# EAGLE design rev0.1 (EAGLE 8.1.0)
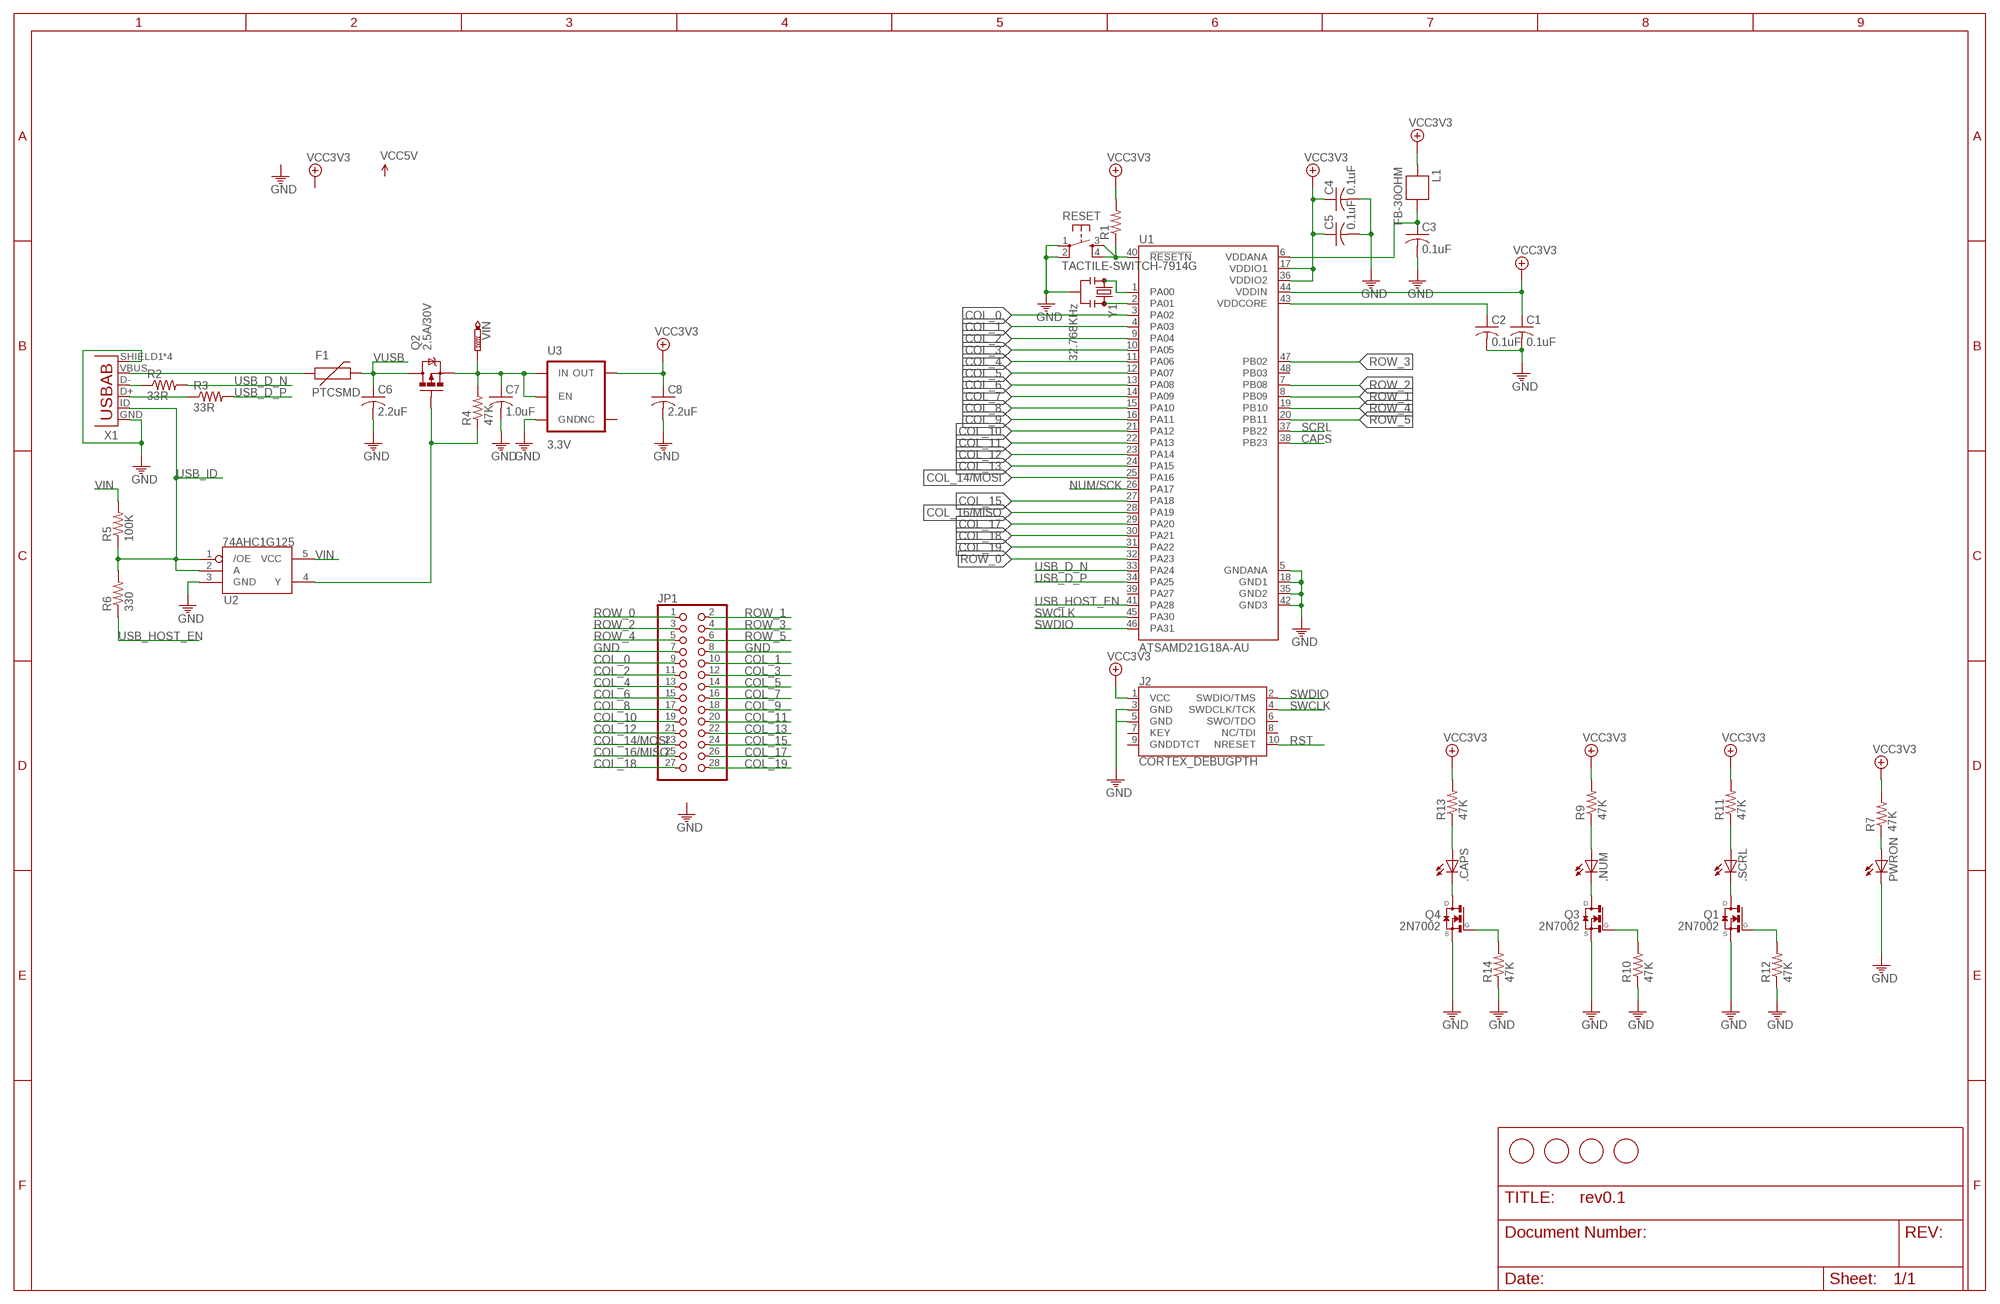
[diagram p0: schematic, sheet 1]

## Parts
.CAPS  LEDCHIPLED_1206  [CHIPLED_1206]
.NUM  LEDCHIPLED_1206  [CHIPLED_1206]
.SCRL  LEDCHIPLED_1206  [CHIPLED_1206]
C1  0.1uF  C-USC0603  [C0603]
C2  0.1uF  C-USC0603  [C0603]
C3  0.1uF  C-USC0603  [C0603]
C4  0.1uF  C-USC0603  [C0603]
C5  0.1uF  C-USC0603  [C0603]
C6  2.2uF  C-USC0603  [C0603]
C7  1.0uF  C-USC0603  [C0603]
C8  2.2uF  C-USC0603  [C0603]
F1  PTCSMD  [PTC-1206]
J2  CORTEX_DEBUGPTH  [2X5-PTH-1.27MM]
JP1  PINHD-2X14-CB  [2X14-CLEANBIG]
L1  FB-30OHM  FB  [0603]
PWRON  LEDCHIPLED_1206  [CHIPLED_1206]
Q1  2N7002  [SOT23]
Q2  2.5A/30V  MOSFET-PCHANNELDMG2307L  [SOT23-3]
Q3  2N7002  [SOT23]
Q4  2N7002  [SOT23]
R1  R-US_R0603  [R0603]
R2  33R  R-US_R0603  [R0603]
R3  33R  R-US_R0603  [R0603]
R4  47K  R-US_R0603  [R0603]
R5  100K  R-US_R0603  [R0603]
R6  330  R-US_R0603  [R0603]
R7  47K  R-US_R0603  [R0603]
R9  47K  R-US_R0603  [R0603]
R10  47K  R-US_R0603  [R0603]
R11  47K  R-US_R0603  [R0603]
R12  47K  R-US_R0603  [R0603]
R13  47K  R-US_R0603  [R0603]
R14  47K  R-US_R0603  [R0603]
RESET  TACTILE-SWITCH-7914G  [7914G]
U1  ATSAMD21G18A-AU  [QFP50P900X900X120-48N]
U2  74AHC1G125  [SOT23-5]
U3  3.3V  V_REG_AP2112K-3.3V  [SOT23-5]
U$6  FIDUCIAL  [FIDUCIAL_1MM]
U$19  FIDUCIAL  [FIDUCIAL_1MM]
U$20  FIDUCIAL  [FIDUCIAL_1MM]
U$21  FIDUCIAL  [FIDUCIAL_1MM]
VIN  PTR1PAD1-17  [P1-17]
X1  USB-AB"  [USB_AB_MICRO_1:1_V2]
Y1  32.768KHz  RESONATOR16MHZ  [RESONATOR-SMD]

## Nets
CAPS: Q4.1(G) R14.2 U1.38(PB23)
COL_0: JP1.9 U1.3(PA02)
COL_1: JP1.10 U1.4(PA03)
COL_2: JP1.11 U1.9(PA04)
COL_3: JP1.12 U1.10(PA05)
COL_4: JP1.13 U1.11(PA06)
COL_5: JP1.14 U1.12(PA07)
COL_6: JP1.15 U1.13(PA08)
COL_7: JP1.16 U1.14(PA09)
COL_8: JP1.17 U1.15(PA10)
COL_9: JP1.18 U1.16(PA11)
COL_10: JP1.19 U1.21(PA12)
COL_11: JP1.20 U1.22(PA13)
COL_12: JP1.21 U1.23(PA14)
COL_13: JP1.22 U1.24(PA15)
COL_14/MOSI: JP1.23 U1.25(PA16)
COL_15: JP1.24 U1.27(PA18)
COL_16/MISO: JP1.25 U1.28(PA19)
COL_17: JP1.26 U1.29(PA20)
COL_18: JP1.27 U1.30(PA21)
COL_19: JP1.28 U1.31(PA22)
D_N: R2.1 X1.D-
D_P: R3.1 X1.D+
GND: C1.2 C2.2 C3.2 C4.2 C5.2 C6.2 C7.2 C8.2 J2.3(GND) J2.5(GND) JP1.7 JP1.8 PWRON.C Q1.2(S) Q3.2(S) Q4.2(S) R10.1 R12.1 R14.1 RESET.1 RESET.2 U1.5(GNDANA) U1.18(GND1) U1.35(GND2) U1.42(GND3) U2.3(GND) U3.2(GND) X1.GND X1.SHIELD1(SHIELD) X1.SHIELD2(SHIELD) X1.SHIELD3(SHIELD) X1.SHIELD4(SHIELD) Y1.2
N$1: U1.1(PA00) Y1.1
N$2: C2.1 U1.43(VDDCORE)
N$3: U1.2(PA01) Y1.3
N$4: C3.1 L1.1 U1.6(VDDANA)
N$6: Q2.1(G) R4.1 U2.4(Y)
N$9: PWRON.A R7.1
N$10: .SCRL.A R11.1
N$11: .NUM.A R9.1
N$12: .NUM.C Q3.3(D)
N$15: .SCRL.C Q1.3(D)
N$24: .CAPS.A R13.1
N$25: .CAPS.C Q4.3(D)
NUM/SCK: Q3.1(G) R10.2 U1.26(PA17)
ROW_0: JP1.1 U1.32(PA23)
ROW_1: JP1.2 U1.8(PB09)
ROW_2: JP1.3 U1.7(PB08)
ROW_3: JP1.4 U1.47(PB02)
ROW_4: JP1.5 U1.19(PB10)
ROW_5: JP1.6 U1.20(PB11)
RST: J2.10(NRESET) R1.1 RESET.3 RESET.4 U1.40(!RESETN)
SCRL: Q1.1(G) R12.2 U1.37(PB22)
SWCLK: J2.4(SWDCLK/TCK) U1.45(PA30)
SWDIO: J2.2(SWDIO/TMS) U1.46(PA31)
USB_D_N: R2.2 U1.33(PA24)
USB_D_P: R3.2 U1.34(PA25)
USB_HOST_EN: R6.1 U1.41(PA28)
USB_ID: R5.1 R6.2 U2.1(/OE) U2.2(A) X1.ID(USBID)
USBVIN: F1.1 X1.VBUS
VCC3V3: C1.1 C4.1 C5.1 C8.1 J2.1(VCC) L1.2 R1.2 R7.2 R9.2 R11.2 R13.2 U1.17(VDDIO1) U1.36(VDDIO2) U1.44(VDDIN) U3.5(OUT)
VIN: C7.1 Q2.2(S) R4.2 R5.2 U2.5(VCC) U3.1(IN) U3.3(EN) VIN.TP
VUSB: C6.1 F1.2 Q2.3(D)
Unconnected: J2.6(SWO/TDO) J2.7(KEY) J2.8(NC/TDI) J2.9(GNDDTCT) U1.39(PA27) U1.48(PB03) U3.4(NC)

## Library data of the parts
.CAPS .NUM .SCRL PWRON = adafruit:LED: LED OSRAM: - CHIPLED LG R971, LG N971, LY N971, LG Q971, LY Q971, LO R971, LY R971 LH N974, LH R974 LS Q976, LO Q976, LY Q976 LO Q996 - Hyper CHIPLED LW Q18S LB Q993, LB Q99A, LB R99A - SideLED LS A670, LO A670, LY A670, LG A670, LP A670 LB A673, LV A673, LT A673, LW A673 LH A674 LY A675 LS A676, LA A676, LO A676, LY A676, LW A676 LS A679, LY A679, LG A679 - Hyper Micro SIDELED® LS Y876, LA Y876, LO Y876, LY Y876 LT Y87S - SmartLED LW L88C, LW L88S LB L89C, LB L89S, LG L890 LS L89K, LO L89K, LY L89K LS L896, LA L896, LO L896, LY L896 - TOPLED LS T670, LO T670, LY T670, LG T670, LP T670 LSG T670, LSP T670, LSY T670, LOP T670, LYG T670 LG T671, LOG T671, LSG T671 LB T673, LV T673, LT T673, LW T673 LH T674 LS T676, LA T676, LO T676, LY T676, LB T676, LH T676, LSB T676, LW T676 LB T67C, LV T67C, LT T67C, LS T67K, LO T67K, LY T67K, LW E67C LS E67B, LA E67B, LO E67B, LY E67B, LB E67C, LV E67C, LT E67C LW T67C LS T679, LY T679, LG T679 LS T770, LO T770, LY T770, LG T770, LP T770 LB T773, LV T773, LT T773, LW T773 LH T774 LS E675, LA E675, LY E675, LS T675 LS T776, LA T776, LO T776, LY T776, LB T776 LHGB T686 LT T68C, LB T68C - Hyper Mini TOPLED® LB M676 - Mini TOPLED Santana® LG M470 LS M47K, LO M47K, LY M47K Source: http://www.osram.convergy.de/
C1-C8 = resistor:C-US: CAPACITOR, American symbol
F1 = SparkFun-PowerIC:PTC: Resettable Fuse PTC Resettable Fuse. Spark Fun Electronics SKU : COM-08357; PROD_ID: RES-11150
J2 = SparkFun-Connectors:CORTEX_DEBUG: Cortex Debug Connector Datasheet <http://infocenter.arm.com/help/topic/com.arm.doc.faqs/attached/13634/cortex_debug_connectors.pdf>
JP1 = adafruit:PINHD-2X14: PIN HEADER
L1 = SparkFun-Passives:FB
Q1 Q3 Q4 = transistor-fet:2N7002*: N-Channel MOSFET
Q2 = SparkFun-DiscreteSemi:MOSFET-PCHANNEL: Generic PMOSFET IRLML2244 - TRANS-11153 (SOT-23 -20V -4.3A) (1.Gate 2.Source 3.Drain) FQP27P06 - COM-10349 <http://www.sparkfun.com/products/10349> (TO-220 -60V -27A) (1.Gate 2.Source 3.Drain); PROD_ID: TRANS-11308
R1-R7 R9-R14 = resistor:R-US_: RESISTOR, American symbol
RESET = GeekAmmo:TACTILE-SWITCH: Tactile Switch 4 Pins, SPST NO
U1 = ATSAMD21G18A-AU:ATSAMD21G18A-AU: Cortex-M0+, 256KB FLASH, 32KB SRAM, USB, DMA, T&R - 48TQFP IND TEMP, GREEN, 1.6-3.6V, 48MHz; AVAILABILITY: Good; DESCRIPTION: Cortex-M0+, 256KB FLASH, 32KB SRAM, USB, DMA, T&amp;R - 48TQFP IND TEMP, GREEN, 1.6-3.6V, 48MHz; MF: Atmel; MP: ATSAMD21G18A-AU; PACKAGE: TQFP-48 Atmel; PRICE: 3.04 USD
U2 = SparkFun-DigitalIC:74AHC1G125: Single bus buffer gate with 3-state output; PROD_ID: IC-11920
U3 = SparkFun-PowerIC:V_REG_AP2112: AP2112 - 600mA CMOS LDO Regulator w/ Enable The AP2112 is CMOS process low dropout linear regulator with enable function, the regulator delivers a guaranteed 600mA (min.) continuous load current. Features Output Voltage Accuracy: ±1.5% Output Current: 600mA (Min.) Foldback Short Current Protection: 50mA Enable Function to Turn ON/OFF VOUT Low Dropout Voltage (3.3V): 250mV (Typ.) @IOUT=600mA Excellent Load Regulation: 0.2%/A (Typ.) Excellent Line Regulation: 0.02%/V (Typ.) Low Quiescent Current: 55μA (Typ.) Low Standby Current: 0.01μA (Typ.) Low Output Noise: 50μVRMS PSRR: 100Hz -65dB, 1kHz -65dB OTSD Protection Stable with 1.0μF Flexible Cap: Ceramic, Tantalum and Aluminum Electrolytic Operation Temperature Range: -40°C to 85°C ESD: MM 400V, HBM 4000V; PROD_ID: VREG-12457
U$6 U$19-U$21 = adafruit:FIDUCIAL: For use by pick and place machines to calibrate the vision/machine, 1mm By microbuilder.eu
VIN = testpad:PTR1: TEST PIN
X1 = SparkFun-Connectors:USB-AB: This is a USB AB connector that is compatible with USB OTG. i.e. this connector can serve as a host or device
Y1 = SparkFun-FreqCtrl:RESONATOR: Resonator Small SMD resonator. Used, eg, on the Arduino Pro/ Pro Mini boards. 8MHz- XTAL-08895 16MHz- XTAL-08900; PROD_ID: XTAL-08900; VALUE: 16MHZ

## Board
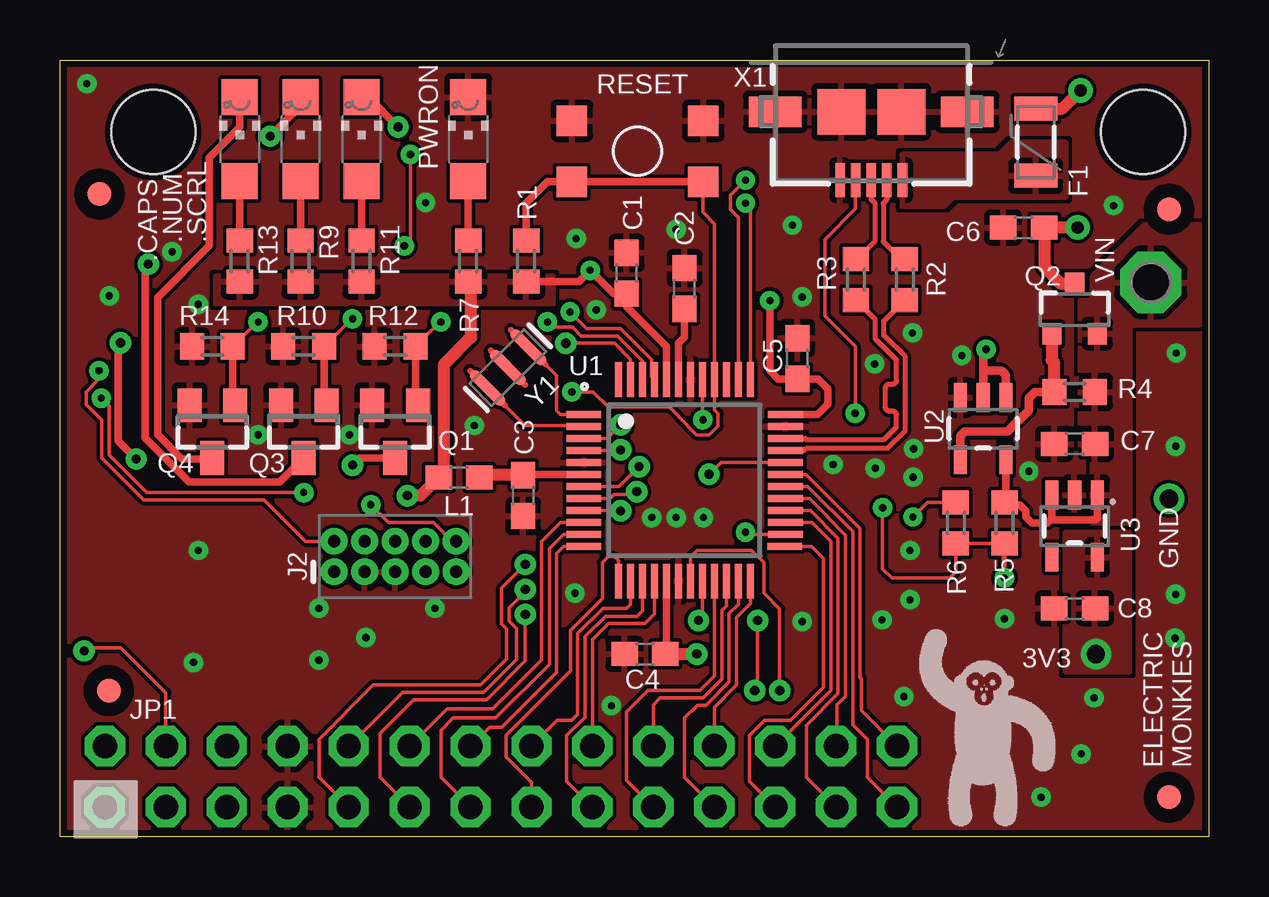
[diagram p1: board, top side]
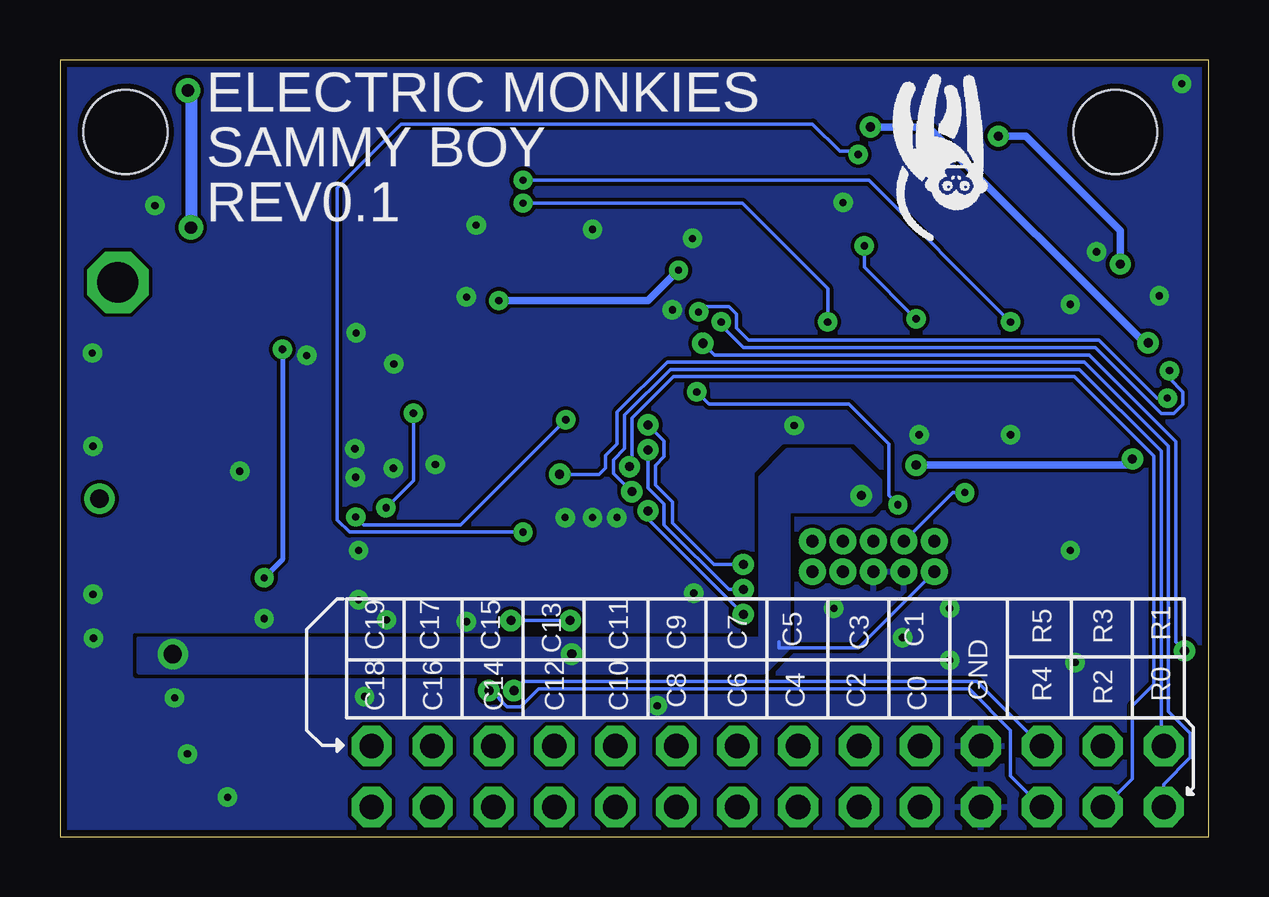
[diagram p2: board, bottom side, seen from below]

Size 47.88 x 32.38 mm. Coordinates in mm from the lower left corner, seen from the top.
Outline: 0,0 0,32.38 47.88,32.38 47.88,0 0,0
Copper layers (1*16): Top 0.035mm / dielectric 1.5mm / Bottom 0.035mm
Design rules "SparkFun *": minimum track width 6mil, minimum drill 0.3mm, track to track 6mil, track to pad 6mil, pad to pad 6mil, via to via 6mil, smd to smd 6mil, copper to edge 10mil, drill to drill 8mil, minimum pad ring 12mil, minimum via ring 10mil, stop-mask expansion 4mil, vias tented up to drill 15mil, thermal gap 10mil
Holes 3.5 mm at 45.14,29.38 3.89,29.38

### Footprints (pad centres in the part's own frame; a part is rotated, then mirrored left to right if it is on the bottom)
CHIPLED_1206 = smd 1.5 x 1.5: A 0,-1.75; C 0,1.75
C0603 = smd 1.1 x 1: 1 -0.85,0; 2 0.85,0
PTC-1206 = smd 1 x 1.8: 1 -1.4,0; 2 1.4,0
2X5-PTH-1.27MM = drill 0.508 pad 1: 1 -2.54,-0.635; 2 -2.54,0.635; 3 -1.27,-0.635; 4 -1.27,0.635; 5 0,-0.635; 6 0,0.635; 7 1.27,-0.635; 8 1.27,0.635; 9 2.54,-0.635; 10 2.54,0.635
2X14-CLEANBIG = drill 1.016 pad 1.676 octagon: 1 -16.51,-1.27; 2 -16.51,1.27; 3 -13.97,-1.27; 4 -13.97,1.27; 5 -11.43,-1.27; 6 -11.43,1.27; 7 -8.89,-1.27; 8 -8.89,1.27; 9 -6.35,-1.27; 10 -6.35,1.27; 11 -3.81,-1.27; 12 -3.81,1.27; 13 -1.27,-1.27; 14 -1.27,1.27; 15 1.27,-1.27; 16 1.27,1.27; 17 3.81,-1.27; 18 3.81,1.27; 19 6.35,-1.27; 20 6.35,1.27; 21 8.89,-1.27; 22 8.89,1.27; 23 11.43,-1.27; 24 11.43,1.27; 25 13.97,-1.27; 26 13.97,1.27; 27 16.51,-1.27; 28 16.51,1.27
0603 = smd 1.1 x 1: 1 -0.85,0; 2 0.85,0
SOT23 = smd 1 x 1.4: 1 -0.95,-1.1; 2 0.95,-1.1; 3 0,1.1
SOT23-3 = smd 0.8 x 0.9: 1 -0.95,-1; 2 0.95,-1; 3 0,1.1
R0603 = smd 1 x 1.1: 1 -0.85,0; 2 0.85,0
7914G = smd 1.27 x 1.27: 1 0,0; 2 0,5.486; 3 2.54,0; 4 2.54,5.486
QFP50P900X900X120-48N = smd 1.45 x 0.3: 1 -4.2,2.75; 2 -4.2,2.25; 3 -4.2,1.75; 4 -4.2,1.25; 5 -4.2,0.75; 6 -4.2,0.25; 7 -4.2,-0.25; 8 -4.2,-0.75; 9 -4.2,-1.25; 10 -4.2,-1.75; 11 -4.2,-2.25; 12 -4.2,-2.75; 25 4.17,-2.75; 26 4.2,-2.25; 27 4.2,-1.75; 28 4.2,-1.25; 29 4.2,-0.75; 30 4.2,-0.25; 31 4.2,0.25; 32 4.2,0.75; 33 4.2,1.25; 34 4.2,1.75; 35 4.2,2.25; 36 4.2,2.75 | smd 0.3 x 1.45: 13 -2.75,-4.2; 14 -2.25,-4.2; 15 -1.75,-4.2; 16 -1.25,-4.2; 17 -0.75,-4.2; 18 -0.25,-4.2; 19 0.25,-4.2; 20 0.75,-4.2; 21 1.25,-4.2; 22 1.75,-4.2; 23 2.25,-4.2; 24 2.75,-4.2; 37 2.75,4.2; 38 2.25,4.2; 39 1.75,4.2; 40 1.25,4.2; 41 0.75,4.2; 42 0.25,4.2; 43 -0.25,4.2; 44 -0.75,4.2; 45 -1.25,4.2; 46 -1.75,4.2; 47 -2.25,4.2; 48 -2.75,4.2
SOT23-5 = smd 0.55 x 1.2: 1 -0.95,-1.3; 2 0,-1.3; 3 0.95,-1.3; 4 0.95,1.3; 5 -0.95,1.3
FIDUCIAL_1MM = smd 1 x 1: 1 0,0
P1-17 = drill 1.702 pad 2.54 octagon: TP 0,0
USB_AB_MICRO_1:1_V2 = smd 1.4 x 0.4: D+ 2.85,0; D- 2.85,0.65; GND 2.85,-1.3; ID 2.85,-0.65; VBUS 2.85,1.3 | smd 1.27 x 2.2: SHIELD1 0,4; SHIELD4 0,-4 | smd 1.9 x 2: SHIELD2 0,1.25; SHIELD3 0,-1.25
RESONATOR-SMD = smd 0.45 x 1.905: 1 -1.2,0; 2 0,0; 3 1.2,0

### Placement (x,y rotation side)
.CAPS  7.49,29.08 0 top
.NUM  10.03,29.08 0 top
.SCRL  12.57,29.08 0 top
C1  23.62,23.5 90 top
C2  26.04,22.86 90 top
C3  19.3,14.22 270 top
C4  24.38,7.62 180 top
C5  30.73,19.94 90 top
C6  40.16,25.4 180 top
C7  42.29,16.38 180 top
C8  42.29,9.53 180 top
DRILEGEND  [DRILEGEND]  76.83,36.2 0 top  (outside the outline)
F1  40.67,28.96 90 top
J2  13.97,11.68 0 top
JP1  18.38,2.51 0 top
L1  16.64,14.99 180 top
PWRON  17.02,29.08 0 top
Q1  13.97,16.89 180 top
Q2  42.29,21.97 0 top
Q3  10.16,16.89 180 top
Q4  6.35,16.89 180 top
R1  19.43,24 270 top
R2  35.21,23.23 270 top
R3  33.18,23.23 270 top
R4  42.29,18.54 0 top
R5  39.37,13.08 90 top
R6  37.34,13.08 270 top
R7  17.02,24 270 top
R9  10.03,24 270 top
R10  10.16,20.45 0 top
R11  12.57,24 270 top
R12  13.97,20.45 0 top
R13  7.49,24 270 top
R14  6.35,20.45 0 top
RESET  21.34,29.84 270 top
U1  26.04,14.86 0 top
U2  38.48,17.02 180 top
U3  42.29,12.95 180 top
U$6  1.65,26.8 0 top
U$19  2.03,6.1 0 top
U$20  46.23,1.65 0 top
U$21  46.23,26.16 0 top
VIN  45.47,23.11 270 top
X1  33.81,30.23 270 top
Y1  18.67,19.56 225 top

### Tracks (layer width: path | path; a pad name or v marks a point on that pad's centre or on a via)
CAPS  (via drill 0.3)
  Top 0.152: U1.38 28.29,25.81 27.94,26.15 27.94,26.74 v28.57,27.38 | v8.26,21.46 8.22,21.46 R14.2
  Top 0.305: R14.2 7.2,18.09 Q4.1
  Bottom 0.152: v28.57,27.38 14.17,27.38 v8.26,21.46
COL_0  (via drill 0.38)
  Top 0.152: JP1.9 10.79,2.47 10.79,4.06 13.06,6.33 17.53,6.33 18.62,7.42 18.62,8.66 18.41,8.87 18.41,10.38 v19.39,11.35 | v23.37,17.17 22.81,16.61 U1.3
  Bottom 0.152: v19.39,11.35 20.61,11.35 22.35,13.09 22.35,13.95 23.06,14.66 23.06,15.49 22.7,15.85 22.7,16.5 v23.37,17.17
COL_1  (via drill 0.38)
  Top 0.152: JP1.10 14.27,6.02 17.65,6.02 19.02,7.39 19.02,8.69 18.72,8.99 18.72,9.55 19.11,9.94 19.21,9.94 19.3,10.03 19.3,10.22 v19.39,10.31 | v23.37,16.13 23.35,16.11 U1.4
  Bottom 0.152: v19.39,10.31 20,10.31 22.7,13 22.7,13.87 23.37,14.54 v23.37,16.13
COL_2  (via drill 0.38)
  Top 0.152: JP1.11 13.34,2.47 13.34,4.32 14.73,5.71 17.78,5.71 19.39,7.33 v19.39,9.27 | v23.37,13.59 23.35,13.61 U1.9
  Bottom 0.152: v19.39,9.27 23.37,13.25 v23.37,13.59
COL_3
  Top 0.152: JP1.12 16.13,5.33 18.03,5.33 20.07,7.37 20.07,12.32 20.86,13.11 U1.10
COL_4
  Top 0.152: JP1.13 15.88,2.47 15.88,4.45 16.38,4.95 18.16,4.95 20.4,7.19 20.4,12.01 20.99,12.61 U1.11
COL_5
  Top 0.152: JP1.14 17.91,4.57 18.41,4.57 20.7,6.86 20.7,11.81 21,12.11 U1.12
COL_6
  Top 0.152: U1.13 23.29,11.51 23.11,11.68 22.86,11.68 22.61,11.43 22.61,9.93 21.28,8.6 21.28,6.91 18.58,4.22 18.58,3.34 19.65,2.27 JP1.15
COL_7
  Top 0.152: U1.14 23.79,9.69 23.62,9.53 22.63,9.53 21.58,8.47 21.58,5.11 21.32,4.84 20.72,4.84 JP1.16
COL_8
  Top 0.152: U1.15 24.29,9.43 24.05,9.2 22.73,9.2 21.89,8.35 21.89,4.98 21.12,4.22 21.12,2.31 JP1.17
COL_9
  Top 0.152: U1.16 24.79,9.29 24.38,8.89 22.86,8.89 22.19,8.22 JP1.18
COL_10
  Top 0.152: U1.21 27.29,6.71 26.67,6.1 24.51,6.1 23.62,5.21 23.62,2.35 JP1.19
COL_11
  Top 0.152: U1.22 27.79,9.62 27.59,9.43 27.59,6.58 26.8,5.79 25.02,5.79 24.73,5.5 JP1.20
COL_12
  Top 0.152: U1.23 28.29,9.69 27.89,9.3 27.89,6.46 26.92,5.49 26.57,5.49 26.04,4.95 26.04,2.47 JP1.21
COL_13
  Top 0.152: U1.24 28.79,9.73 28.2,9.15 28.2,6.33 27.27,5.4 JP1.22
COL_14/MOSI
  Top 0.152: JP1.23 28.74,2.31 28.74,4.22 29.37,4.84 30.45,4.84 31.83,6.22 31.83,11.61 31.32,12.11 U1.25
COL_15
  Top 0.152: JP1.24 32.13,6.1 32.13,12.32 31.34,13.11 U1.27
COL_16/MISO
  Top 0.152: JP1.25 31.11,2.47 31.11,4.65 32.44,5.97 32.44,12.45 31.27,13.61 U1.28
COL_17
  Top 0.152: JP1.26 32.38,3.81 32.38,5.49 32.74,5.84 32.74,12.57 32,13.31 32,13.34 31.23,14.11 U1.29
COL_18
  Top 0.152: JP1.27 33.66,2.47 33.66,4.06 33.05,4.67 33.05,12.72 31.16,14.61 U1.30
COL_19
  Top 0.152: JP1.28 33.4,5.27 33.4,6.6 33.35,6.66 33.35,12.85 31.09,15.11 U1.31
D_N
  Top 0.203: X1.D- 34.46,26.57 34.31,26.42 34.31,24.82 35.06,24.07 R2.1
D_P
  Top 0.203: X1.D+ 33.81,26.56 33.96,26.42 33.96,24.82 33.22,24.07 R3.1
GND  (via drill 0.3)
  other vias: 22.99,5.46 35.56,14.99 8.26,16.76 12.06,16.76 35.43,11.94 35.18,5.84 10.79,7.37 15.62,9.53 10.79,9.53 40.39,15.24 37.59,20.07 35.43,9.88 39.37,9.09 34.26,9.04 30.94,8.97 43.1,5.79 42.57,3.45 5.56,7.26 5.77,11.94 2.06,22.56 1.12,31.39 43.92,26.31 46.53,20.17 46.51,16.28 46.51,10.11 46.48,8.28 40.89,1.65 25.68,13.31 30.53,25.5 35.53,21.01 33.96,19.71 35.59,16.18 32.23,15.52 33.99,15.37 30.94,22.5 25.68,25.32 21.51,24.94 15.24,26.44 5.77,22.2 4.67,24.38 12.75,8.31 17.27,17.14 21.46,10.16 22.35,21.97 24.66,13.31 26.82,13.31
  pour Top (rank 5): 0,32.26 47.88,32.26 47.88,0.13 0,0
  pour Bottom (rank 5): 0,32.26 47.88,32.26 47.88,0.13 0,0
N$1
  Top 0.152: U1.1 20.87,17.61 20.7,17.78 20.7,19.22 20.49,19.44 | 20.49,19.44 | 20.49,19.44 Y1.1
N$2
  Top 0.305: C2.1 26.04,20.83 25.78,20.57 U1.43
N$3
  Top 0.152: Y1.3 19.39,17.14 21.8,17.14 U1.2
N$4
  Top 0.305: U1.6 19.34,15.11 C3.1
  Top 0.508: C3.1 17.57,15.07 L1.1
N$5  (via drill 0.76)
  other vias: 46.23,14.1
N$6
  Top 0.356: U2.4 37.53,16.7 37.72,16.89 39.5,16.89 40.39,17.78 40.39,18.29 40.64,18.54 R4.1
  Top 0.508: Q2.1 41.34,19.87 41.44,19.77 R4.1
N$9
  Top 0.305: R7.1 PWRON.A
N$10
  Top 0.305: R11.1 .SCRL.A
N$11
  Top 0.305: R9.1 .NUM.A
N$12  (via drill 0.38)
  Top 0.305: .NUM.C 10.03,30.48 v8.76,29.21 | v3.68,23.88 3.56,23.75 3.56,16.62 5.39,14.79 9.15,14.79 Q3.3
  Bottom 0.305: v8.76,29.21 7.62,29.21 3.68,25.27 v3.68,23.88
N$15  (via drill 0.38)
  Top 0.305: Q1.3 12.49,15.79 v12.19,15.49 | .SCRL.C 12.86,30.83 v14.1,29.59 | v2.52,20.6 2.43,20.5 2.43,16.5 v3.17,15.75
  Bottom 0.305: v12.19,15.49 3.43,15.49 v3.17,15.75 | v2.52,20.6 2.69,20.6 11.68,29.59 v14.1,29.59
N$24
  Top 0.305: R13.1 .CAPS.A
N$25
  Top 0.305: .CAPS.C 7.49,29.59 6.22,28.32 6.22,24.64 4.06,22.48 4.06,16.76 5.08,15.75 6.31,15.75 Q4.3
NUM/SCK  (via drill 0.3)
  Top 0.152: U1.26 28.67,12.61 v28.57,12.7 | v14.61,28.45 14.61,24.89 v14.35,24.64 | v12.19,21.59 12.03,21.46 R10.2
  Top 0.305: R10.2 11.01,18.09 Q3.1
  Bottom 0.152: v28.57,12.7 35.81,12.7 36.32,13.21 36.32,27.05 33.66,29.72 16.51,29.72 15.37,28.57 14.73,28.57 v14.61,28.45 | v14.35,24.64 14.35,23.75 v12.19,21.59
ROW_0  (via drill 0.38)
  Top 0.152: v27.05,15.11 27.55,15.61 U1.32
  Bottom 0.152: JP1.1 1.87,2.19 0.76,3.3 0.76,4.32 1.68,5.23 1.68,16.28 5.18,19.79 22.57,19.79 24.65,17.7 24.65,16.38 25.15,15.89 25.15,15.37 25.4,15.11 v27.05,15.11
ROW_1  (via drill 0.38)
  Top 0.152: U1.8 22.94,14.11 23.09,14.26 23.91,14.26 v24.04,14.39
  Bottom 0.152: v24.04,14.39 24.41,14.76 24.42,14.76 24.82,15.15 24.82,15.71 24.35,16.18 24.35,17.57 22.44,19.48 5.38,19.48 1.98,16.08 1.98,3.89 JP1.2
ROW_2  (via drill 0.38)
  Top 0.152: v24.14,15.43 23.77,15.06 23.76,15.06 23.31,14.61 U1.7
  Bottom 0.152: v24.14,15.43 24.04,15.53 24.04,17.45 22.31,19.18 5.59,19.18 2.29,15.88 2.29,6.35 3.17,5.46 3.17,2.41 4.35,1.24 JP1.3
ROW_3  (via drill 0.38)
  Top 0.152: U1.47 23.79,19.9 23.11,20.57 v21.08,20.57 | JP1.4 4.41,6 2.54,7.87 1.13,7.87 v1,7.75
  Bottom 0.152: v1,7.75 1.37,8.12 1.37,16.48 4.98,20.09 20.6,20.09 v21.08,20.57
ROW_4  (via drill 0.38)
  Top 0.152: v30,6.1 30,9.5 29.34,10.16 29.34,11.43 28.83,11.94 26.54,11.94 26.29,11.68 U1.19
  Bottom 0.152: JP1.5 8.26,2.54 8.26,4.45 9.98,6.17 27.93,6.17 28.68,5.42 29.23,5.42 29.91,6.1 v30,6.1
ROW_5  (via drill 0.38)
  Top 0.152: v28.96,6.1 29.08,6.22 v29.08,9.02 | v26.61,9.02 26.79,9.19 U1.20
  Bottom 0.152: JP1.6 9.65,6.48 28.57,6.48 v28.96,6.1 | v29.08,9.02 v26.61,9.02
RST  (via drill 0.3)
  Top 0.152: RESET.4 26.8,27.28 26.8,26.04 27.29,25.55 U1.40 27.29,17.79 27.43,17.65 27.43,17.12 27.06,16.75 26.54,16.75 26.16,17.12 26.16,17.14 25.4,17.91 22.86,17.91 22.22,18.54 v21.34,18.54 | v12.95,13.84 13.69,13.11 15.57,13.11 16.35,12.32 J2.10
  Top 0.305: RESET.4 RESET.3 20.32,27.3 19.43,26.42 R1.1
  Bottom 0.152: v21.34,18.54 20.83,18.03 14.99,18.03 13.34,16.38 13.34,14.22 v12.95,13.84
SCRL  (via drill 0.3)
  Top 0.152: U1.37 28.79,26.21 v28.57,26.42 | v15.88,21.46 15.46,21.08 R12.2
  Top 0.305: R12.2 14.82,18.09 Q1.1
  Bottom 0.152: v28.57,26.42 19.43,26.42 15.88,22.86 v15.88,21.46
SWCLK  (via drill 0.3)
  Top 0.152: v21.26,21.88 21.96,21.18 23.37,21.18 24.66,19.89 24.66,19.18 U1.45 | v1.72,18.29 2.04,17.96 2.04,15.93 3.62,14.35 v10.16,14.35
  Bottom 0.152: v21.26,21.88 21.04,22.1 19.99,22.1 19.68,21.79 19.68,21.21 19.18,20.7 4.57,20.7 2.16,18.29 v1.72,18.29 | v10.16,14.35 10.67,14.35 J2.4
SWDIO  (via drill 0.3)
  Top 0.152: v20.32,21.46 20.54,21.25 21.36,21.25 21.73,20.88 23.24,20.88 24.29,19.83 U1.46 | v1.63,19.43 1.63,19.09 1.08,18.55 1.08,18.03 1.74,17.37 1.74,15.8 3.49,14.05 8.51,14.05 10.24,12.32 J2.2
  Bottom 0.152: v20.32,21.46 20.32,21.34 19.38,20.4 4.72,20.4 1.98,17.66 1.46,17.66 1.08,18.03 1.08,18.55 1.63,19.09 v1.63,19.43
USB_D_N
  Top 0.203: U1.33 31.02,16.11 31.11,16.2 34.49,16.2 35.23,16.94 35.23,20.01 34.34,20.9 34.34,21.5 R2.2
USB_D_P
  Top 0.203: U1.34 31.07,16.61 31.11,16.56 34.34,16.56 34.87,17.09 34.87,17.57 arc90 34.7,17.74 34.58,17.74 arc-90 34.4,17.92 34.4,18.69 arc-90 34.58,18.87 34.7,18.87 arc90 34.87,19.05 34.87,19.86 33.98,20.75 33.98,21.57 R3.2
USB_HOST_EN  (via drill 0.3)
  Top 0.152: v35.55,13.33 36.15,13.93 R6.1 | U1.41 26.79,17.4 v26.8,17.38
  Bottom 0.152: v35.55,13.33 35.22,13.01 31.18,13.01 v26.8,17.38
USB_ID  (via drill 0.3)
  Top 0.152: X1.ID 33.16,26.18 31.88,24.89 31.88,21.72 33.15,20.45 v33.15,17.65 | v34.29,13.72 34.29,11.18 34.67,10.79 37.08,10.79 37.34,11.05 R6.2 R5.1
  Top 0.203: v39.37,10.79 R5.1
  Top 0.356: U2.1 39.43,19.24 39.24,19.43 38.61,19.43 38.48,19.3 | 38.48,19.3 U2.2 | 38.48,19.3 38.48,20.19 v38.61,20.32
  Bottom 0.152: v33.15,17.65 33.15,14.86 v34.29,13.72
  Bottom 0.203: v38.61,20.32 38.61,11.56 v39.37,10.79
USBVIN
  pour Top: 35.08,28.45 35.08,26.29 36.86,26.29 37.24,26.67 41.94,26.67 41.94,28.96 39.66,28.96 39.15,28.45
VCC3V3  (via drill 0.3, 0.38, 0.76)
  Top 0.305: U1.17 25.29,7.67 C4.1 | U1.44 25.29,20.43 23.62,22.1 C1.1 23.07,22.64 v22.1,23.62 21.63,23.15 R1.2 | U1.36 31.58,17.61 32,18.03 32,18.67 31.58,19.09 C5.1 29.93,19.09 29.59,19.43 v29.59,22.35
  Top 0.508: C4.1 v26.54,7.62 | v14.48,14.22 15.03,14.22 L1.2 16,15.2 16,19.68 17.14,20.83 17.14,23.03 R7.2
  Bottom 0.152: 17.91,8.13 17.91,7.87 14.61,7.87 J2.1
  Bottom 0.305: v22.1,23.62 23.37,22.35 v29.59,22.35
  other vias: 43.18,7.62
  pour Top: 44.58,12.7 44.58,6.86 41.91,6.86 41.91,12.7
  pour Top: 6.48,23.37 6.48,22.23 20.57,22.23 20.57,23.37
  pour Bottom: 44.58,6.86 44.58,8.26 18.67,8.26 18.67,14.99 17.53,16.13 14.99,16.13 13.72,14.86 13.72,13.97 14.1,13.59 17.53,13.59 17.53,7.87 18.54,6.86
VIN
  Top 0.305: U2.5 39.43,13.99 R5.2 39.46,13.84 40.01,13.84 40.26,13.59 40.26,13.34 40.51,13.08 41.15,13.08 41.34,13.27 | U3.3 41.34,13.27 | 41.34,13.27 41.41,13.21 43.18,13.21 43.24,13.27 U3.1
  pour Top (rank 2): 45.21,25.53 47.5,25.53 47.5,21.34 44.58,21.34 44.58,13.08 43.05,13.08 43.05,15.62 42.55,15.62 42.55,22.35 43.05,22.35 43.05,23.37
VUSB  (via drill 0.51)
  Top 0.508: F1.2 41.79,30.36 v42.55,31.11 | v42.42,25.4 C6.1 41.02,25.39 41.02,23.75 41.7,23.07 Q2.3
  Bottom 0.508: v42.55,31.11 42.42,30.99 v42.42,25.4

### Text on the board
Top: TOP
Bottom: BOTTOM
tPlace: GND | 3V3 | TOP PLACE | ELECTRIC / MONKIES
bPlace: ELECTRIC MONKIES | SAMMY BOY | REV0.1 | R1 | R3 | R5 | C11 | C13 | C15 | C17 | C19 | C1 | C3 | C5 | C7 | C9 | GND | R0 | R2 | R4 | C0 | C2 | C4 | C6 | C8 | C10 | C12 | C14 | C16 | C18 | BOTTOM PLACE
tNames: TOP NAME
bNames: BOTTOM NAME
DrillLegend: LAYER-STACK
DrillLegend_01-16: 01-16
DrillLegend_01-20: 01-20